# Altium project Vyadh_DevBoard_v1.PrjPcb
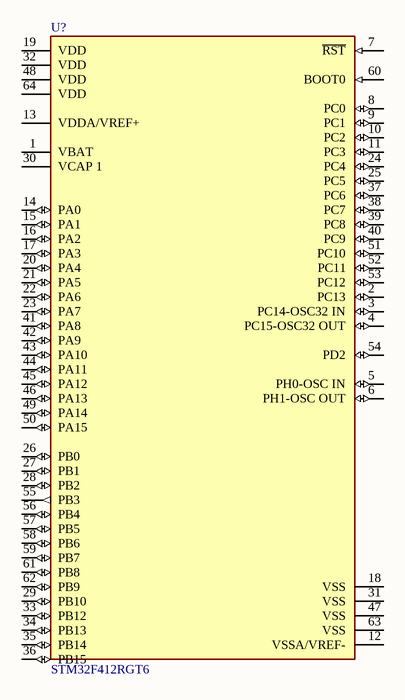
[diagram p0: DevBoard_v1.SchDoc]
1 sheet, 1 parts. Net scope: global (net labels, ports and power ports of the same name join across sheets).

## Sheet DevBoard_v1.SchDoc
size A3; SheetNumber: 1; SheetTotal: 1

### Parts
U?  STM32F412RGT6  [FP-LQFP64-5W-IPC_C]

### Nets

Not connected (* = marked no-connect by the designer): U? 1(VBAT) 2(PC13) 3(PC14-OSC32_IN) 4(PC15-OSC32_OUT) 5(PH0-OSC_IN) 6(PH1-OSC_OUT) 7(~{RST}) 8(PC0) 9(PC1) 10(PC2) 11(PC3) 12(VSSA/VREF-) 13(VDDA/VREF+) 14(PA0) 15(PA1) 16(PA2) 17(PA3) 18(VSS) 19(VDD) 20(PA4) 21(PA5) 22(PA6) 23(PA7) 24(PC4) 25(PC5) 26(PB0) 27(PB1) 28(PB2) 29(PB10) 30(VCAP_1) 31(VSS) 32(VDD) 33(PB12) 34(PB13) 35(PB14) 36(PB15) 37(PC6) 38(PC7) 39(PC8) 40(PC9) 41(PA8) 42(PA9) 43(PA10) 44(PA11) 45(PA12) 46(PA13) 47(VSS) 48(VDD) 49(PA14) 50(PA15) 51(PC10) 52(PC11) 53(PC12) 54(PD2) 55(PB3) 56(PB4) 57(PB5) 58(PB6) 59(PB7) 60(BOOT0) 61(PB8) 62(PB9) 63(VSS) 64(VDD)

### Library data of the parts
U? = CMP-12105-000147-1: IC MCU 32BIT 1MB FLASH 64LQFP; Min Supply Voltage: 1.7V; Watchdog Timer: Yes; Oscillator Type: Internal; Max Supply Voltage: 3.6V; Frequency: 100MHz; Peripherals: Brown-out Detect/Reset; Number of Programmable I/O: 50; RAM Size: 32KB; Number of Timers/Counters: 14; Core Architecture: ARM; Interface: I2C; Max Power Dissipation: 425mW; Mount: Surface Mount; Min Operating Temperature: -40°C; Memory Size: 1MB; Number of I/Os: 50; Case/Package: LQFP; Max Operating Temperature: 85°C; Max Frequency: 100MHz; Memory Type: FLASH; Number of Pins: 64; RoHS Compliant: Yes